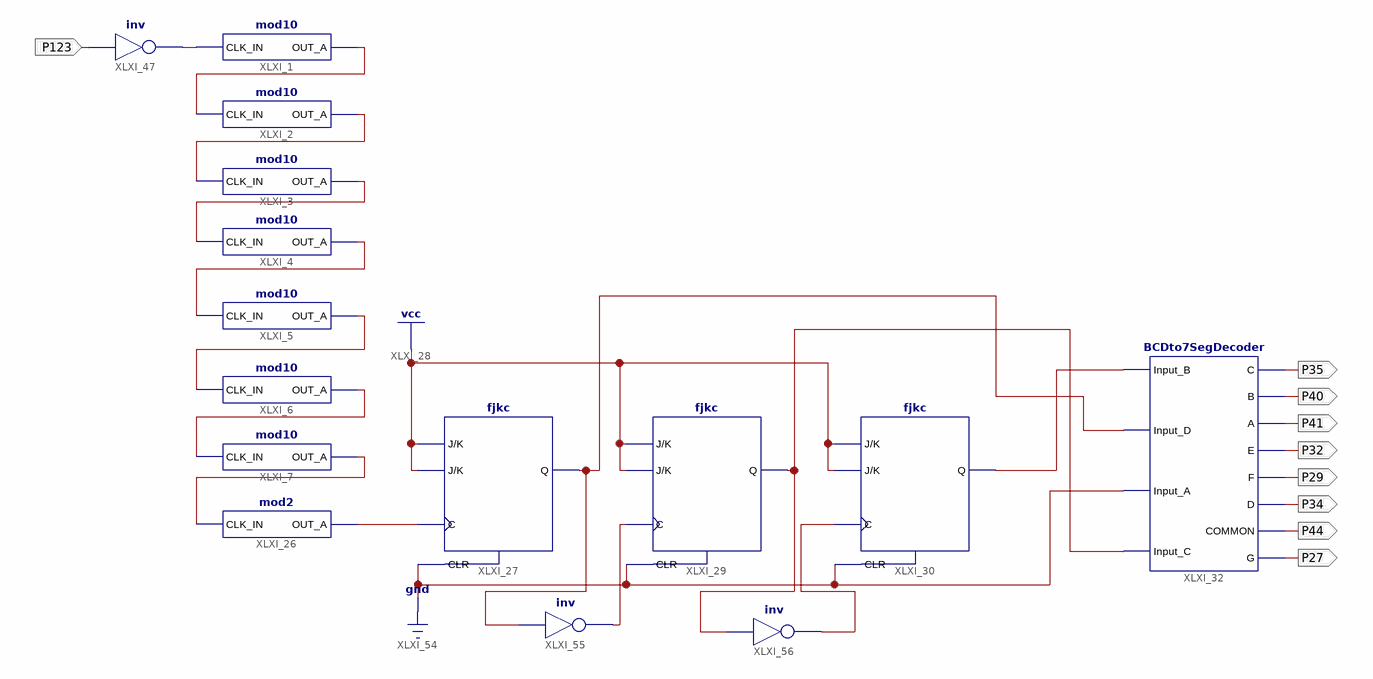
[diagram p0: schematic sheet 1]
// Xilinx ISE schematic Lab5b.sch (spartan6) as structural Verilog: 15 symbols, 9 ports
module Lab5b (
  input  P123,
  output P35,
  output P40,
  output P41,
  output P32,
  output P29,
  output P34,
  output P27,
  output P44
);

  wire XLXN_3, XLXN_4, XLXN_5, XLXN_6, XLXN_7, XLXN_27, XLXN_86, XLXN_87, XLXN_91, XLXN_134, XLXN_170,
       XLXN_173, XLXN_175, XLXN_178;

  mod10 XLXI_1 (.CLK_IN(XLXN_134), .OUT_A(XLXN_3));
  mod10 XLXI_2 (.CLK_IN(XLXN_3), .OUT_A(XLXN_4));
  mod10 XLXI_3 (.CLK_IN(XLXN_4), .OUT_A(XLXN_5));
  mod10 XLXI_4 (.CLK_IN(XLXN_5), .OUT_A(XLXN_6));
  mod10 XLXI_5 (.CLK_IN(XLXN_6), .OUT_A(XLXN_7));
  mod10 XLXI_6 (.CLK_IN(XLXN_7), .OUT_A(XLXN_27));
  mod10 XLXI_7 (.CLK_IN(XLXN_27), .OUT_A(XLXN_86));
  mod2 XLXI_26 (.CLK_IN(XLXN_86), .OUT_A(XLXN_87));
  fjkc XLXI_27 (.C(XLXN_87), .CLR(1'b0), .J(1'b1), .K(1'b1), .Q(XLXN_173));
  fjkc XLXI_29 (.C(XLXN_175), .CLR(1'b0), .J(1'b1), .K(1'b1), .Q(XLXN_91));
  not XLXI_47 (XLXN_134, P123);
  BCDto7SegDecoder XLXI_32 (
    .Input_B(XLXN_170), .Input_D(XLXN_173), .Input_A(1'b0), .Input_C(XLXN_91), .C(P35), .B(P40), .A(P41),
    .E(P32), .F(P29), .D(P34), .COMMON(P44), .G(P27));
  fjkc XLXI_30 (.C(XLXN_178), .CLR(1'b0), .J(1'b1), .K(1'b1), .Q(XLXN_170));
  not XLXI_55 (XLXN_175, XLXN_173);
  not XLXI_56 (XLXN_178, XLXN_91);
endmodule
